# EAGLE schematic components_connections (EAGLE 9.7.0)
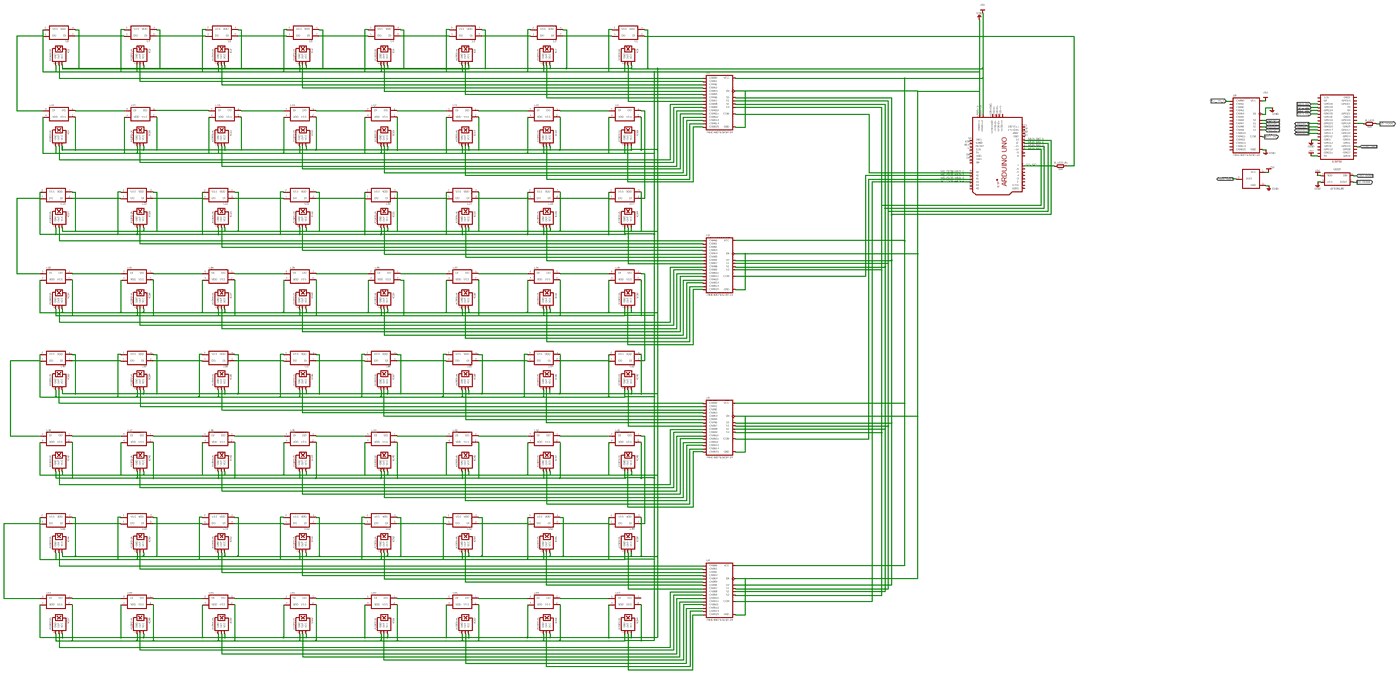
[diagram p0: schematic, sheet 1, overview]
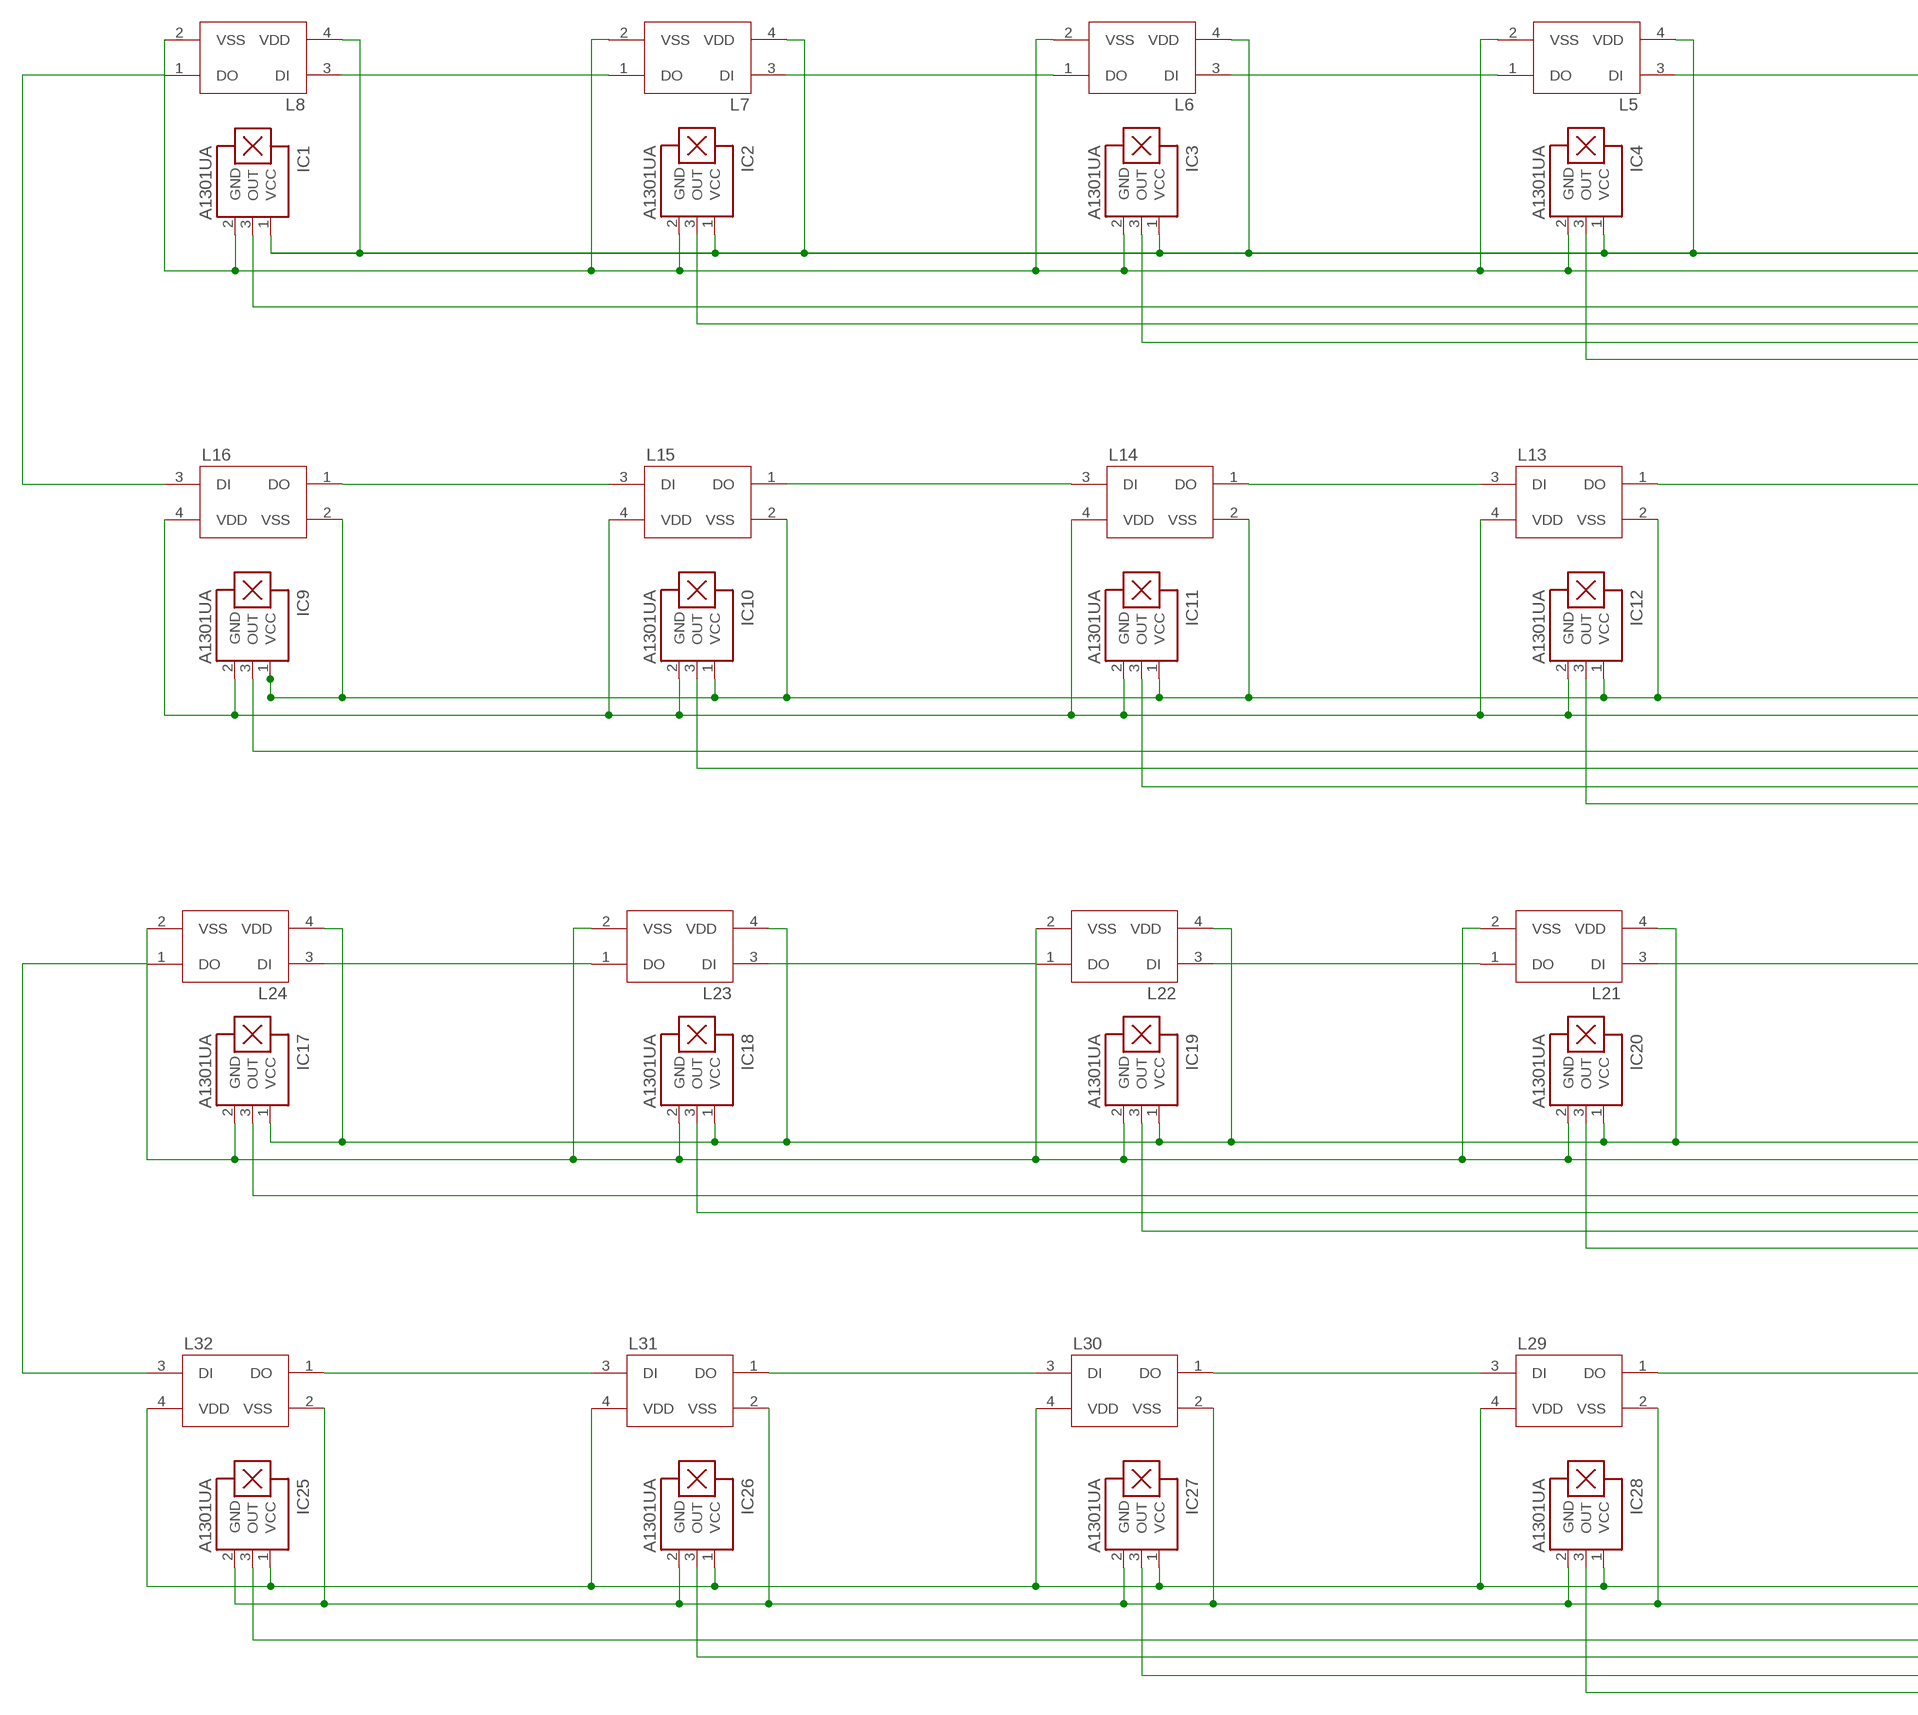
[diagram p1: schematic, sheet 1, part 1 of 5]
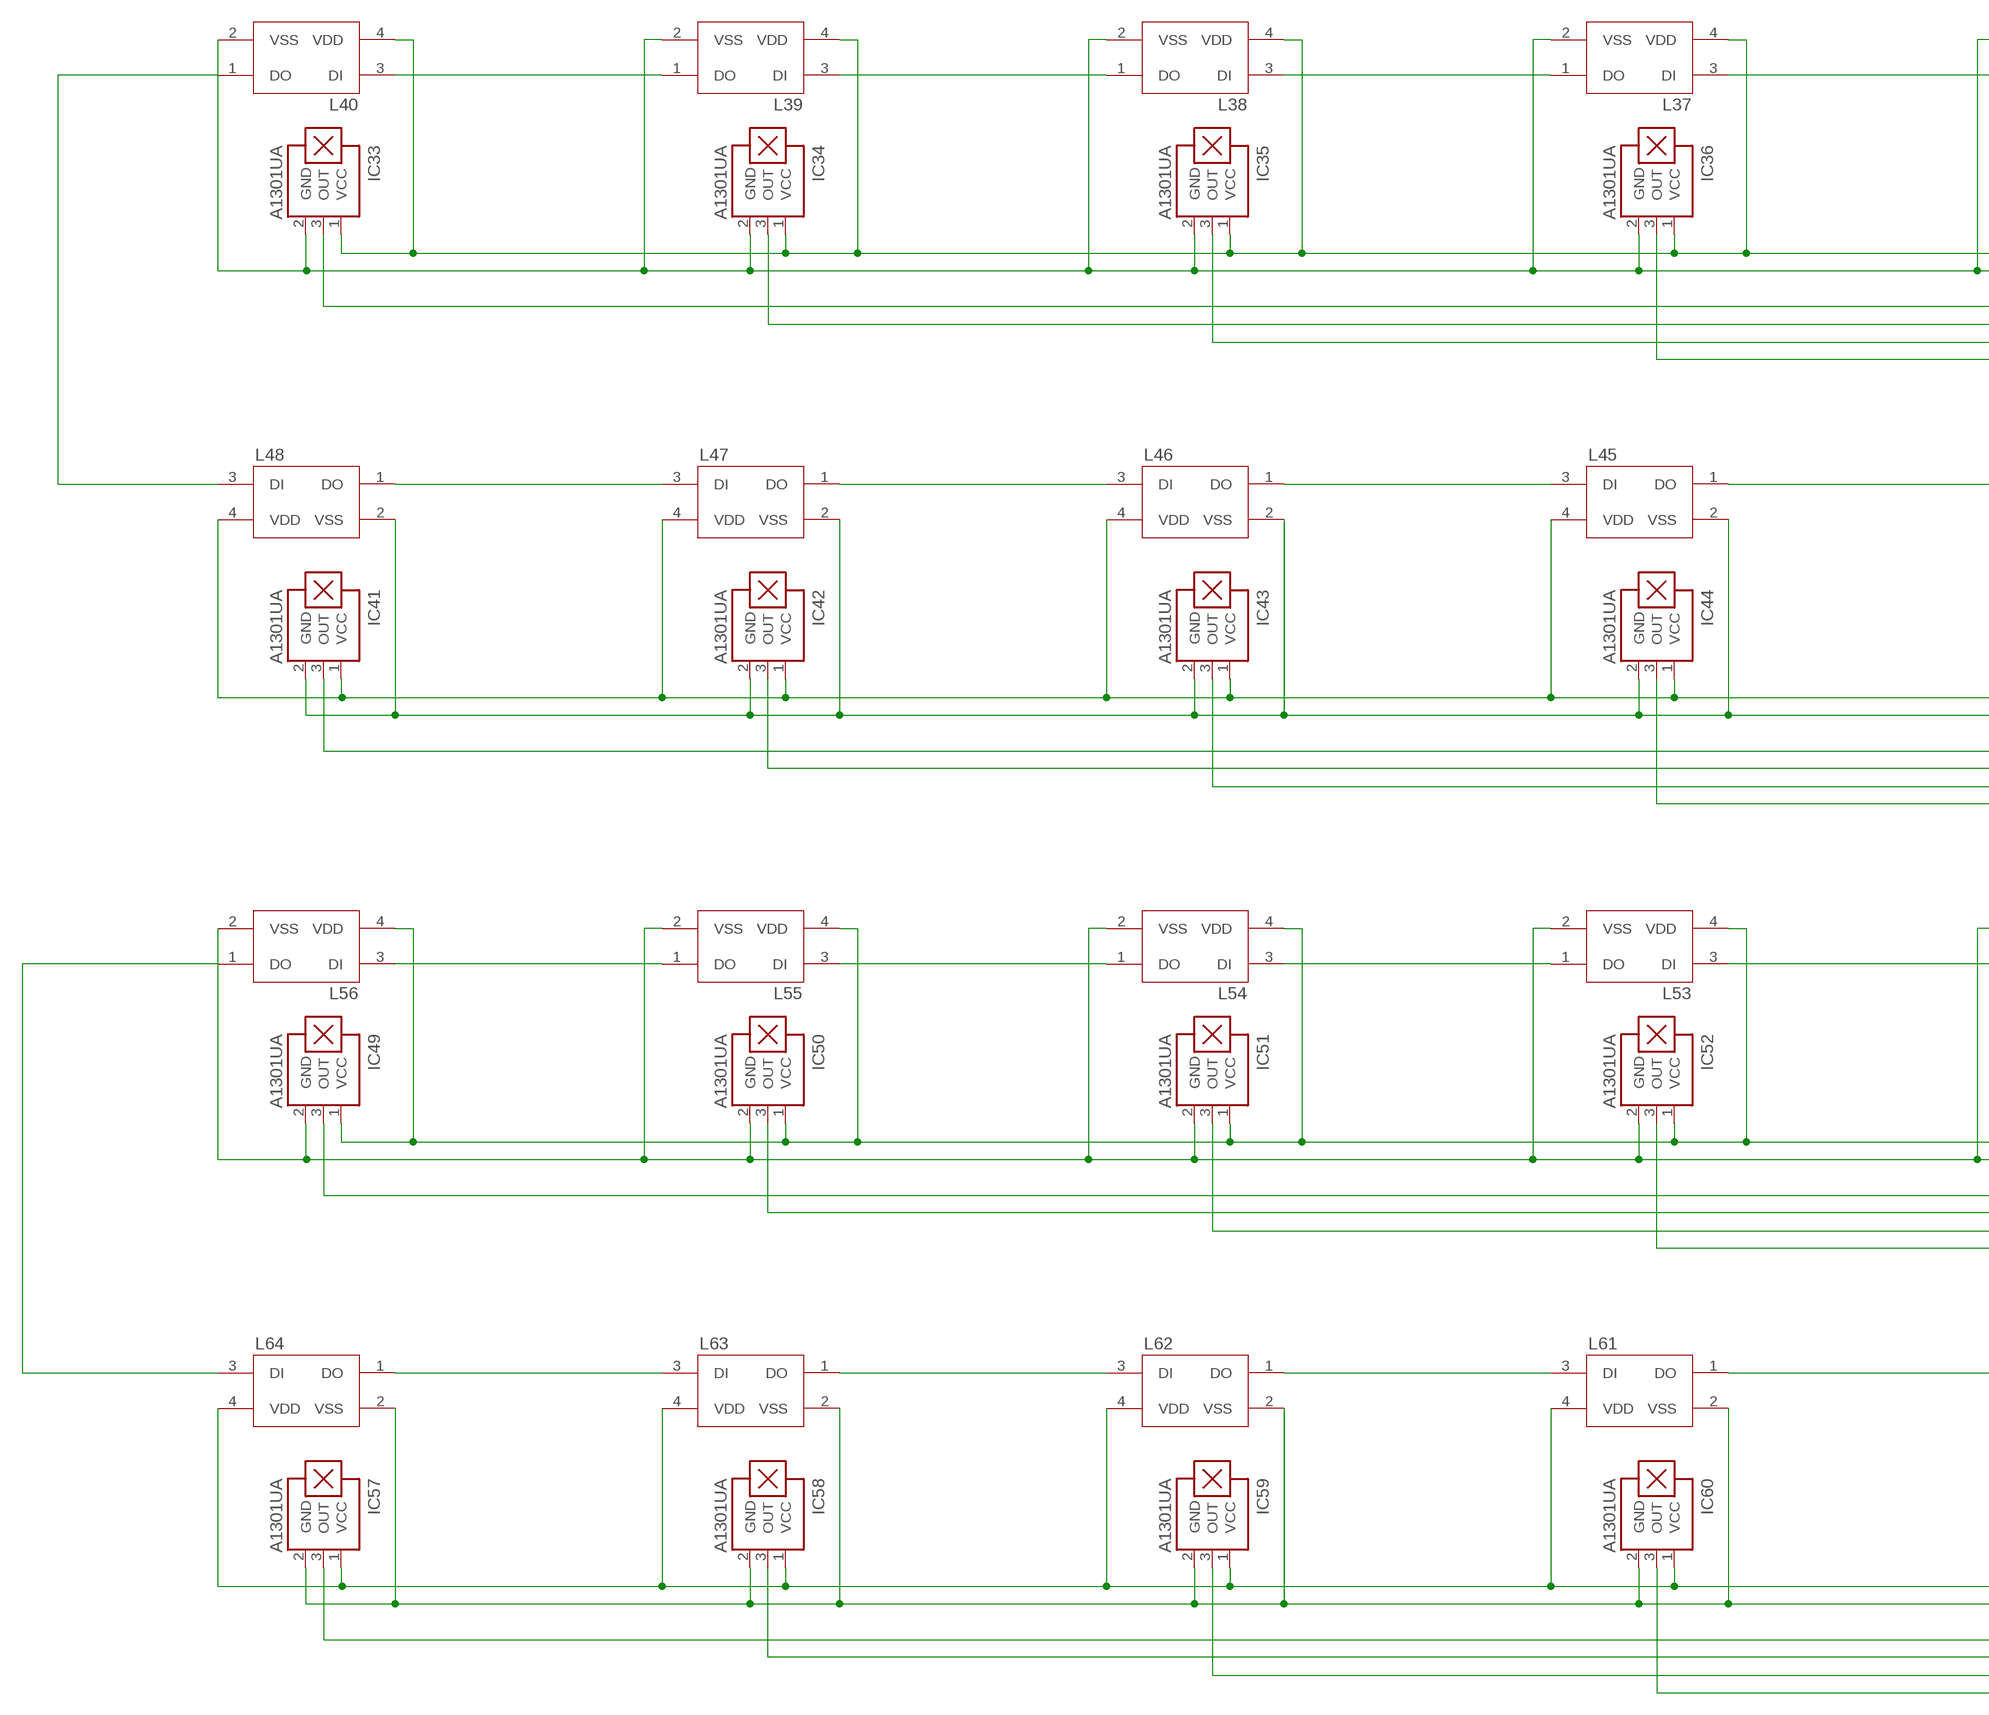
[diagram p2: schematic, sheet 1, part 2 of 5]
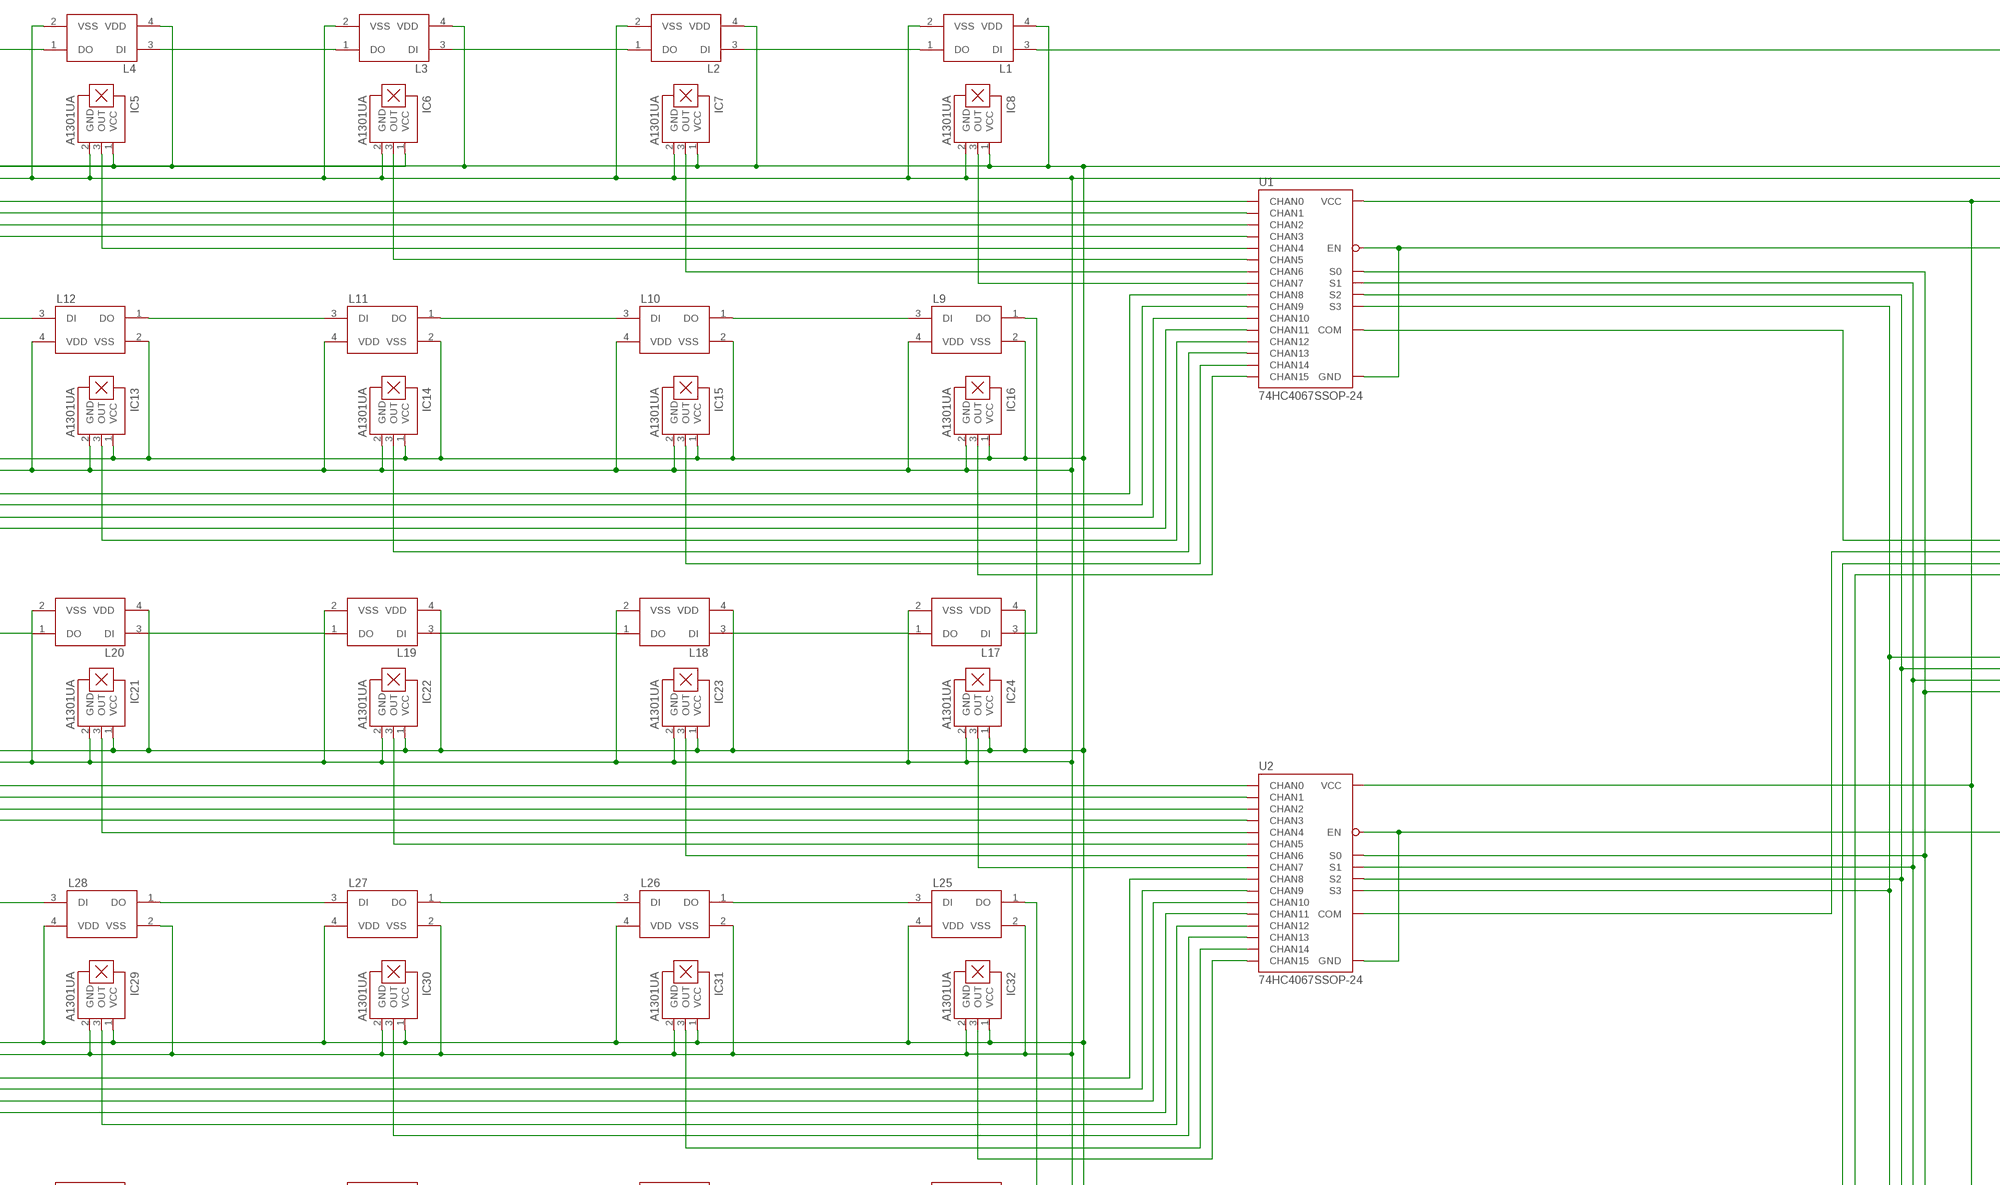
[diagram p3: schematic, sheet 1, part 3 of 5]
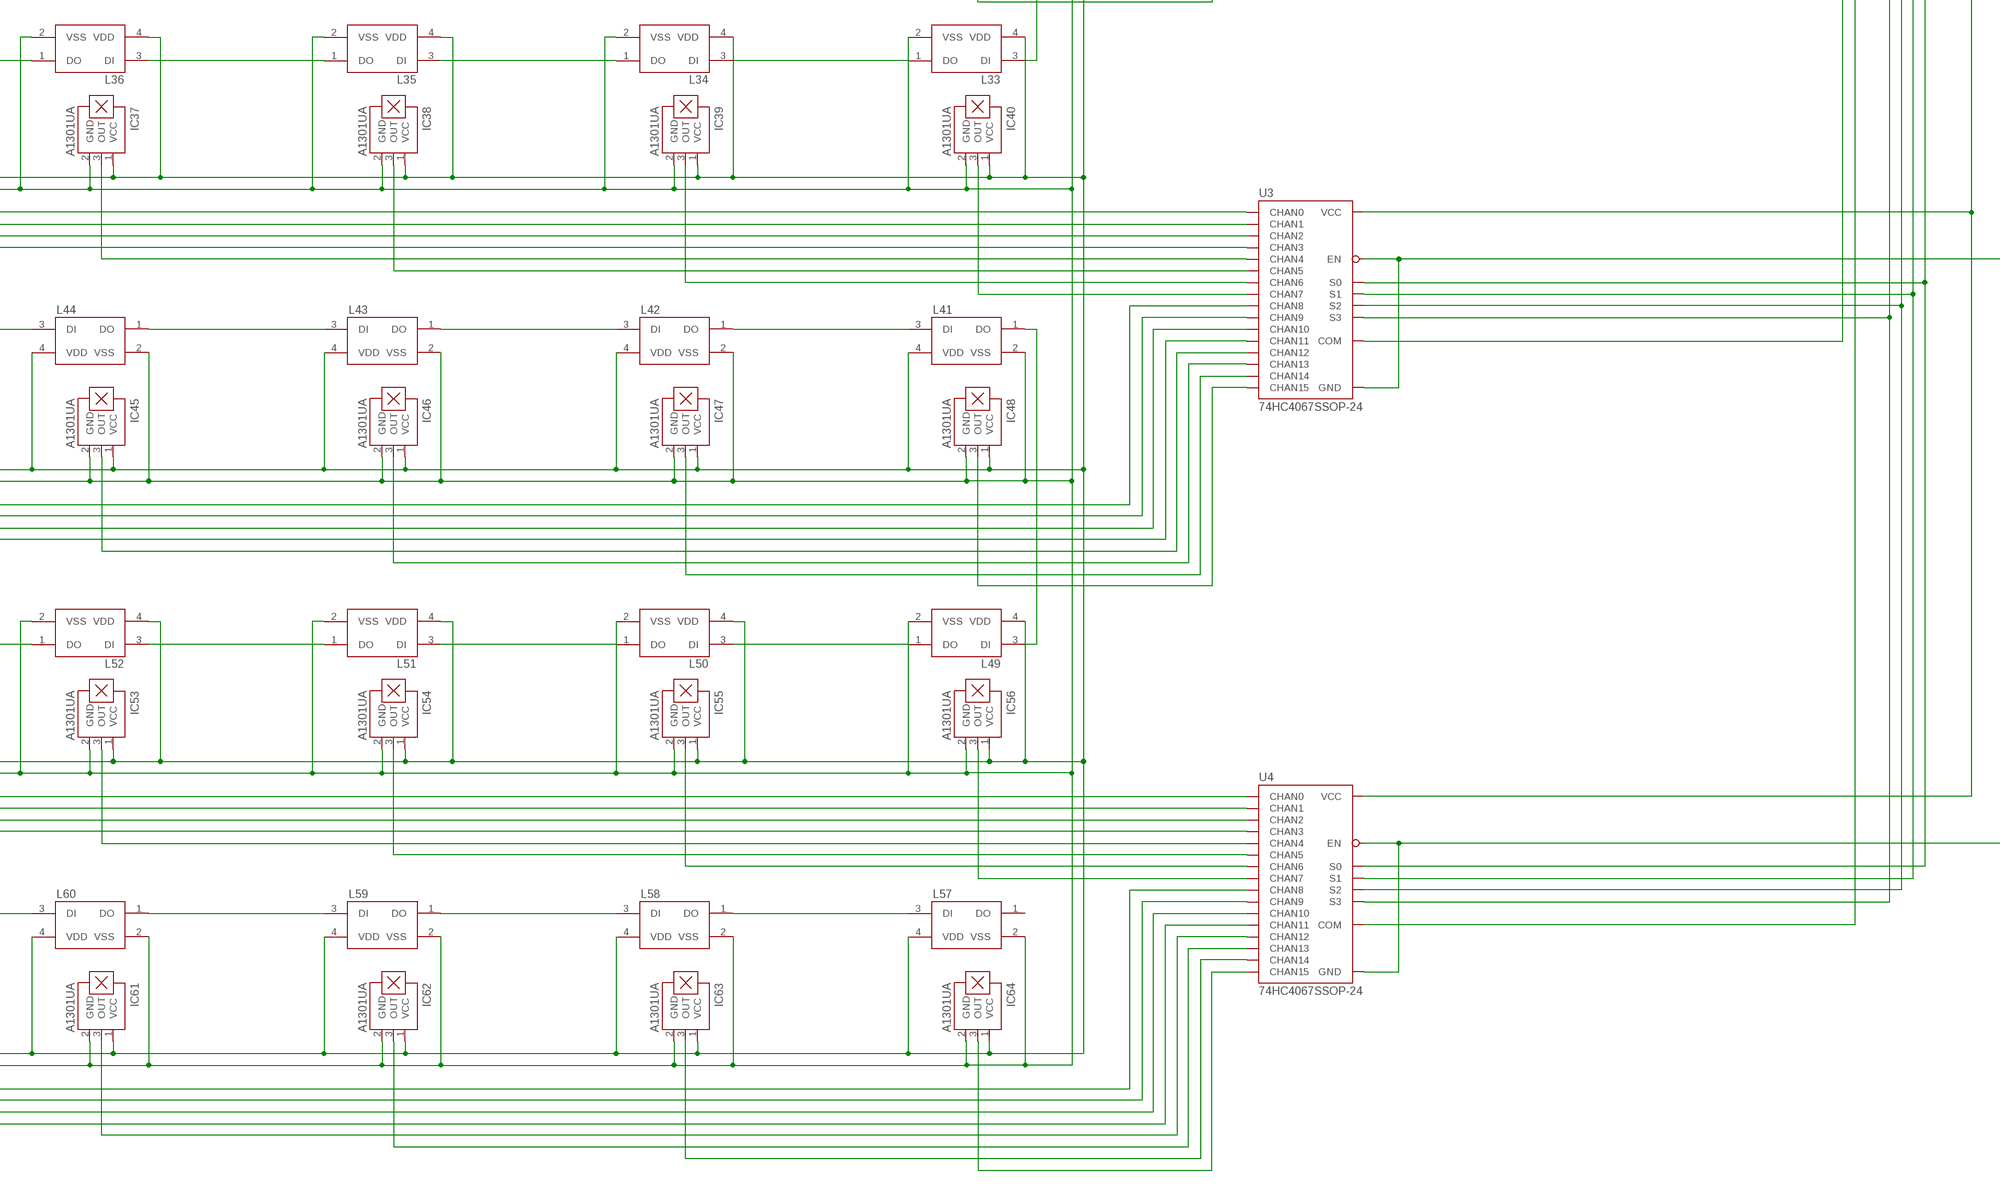
[diagram p4: schematic, sheet 1, part 4 of 5]
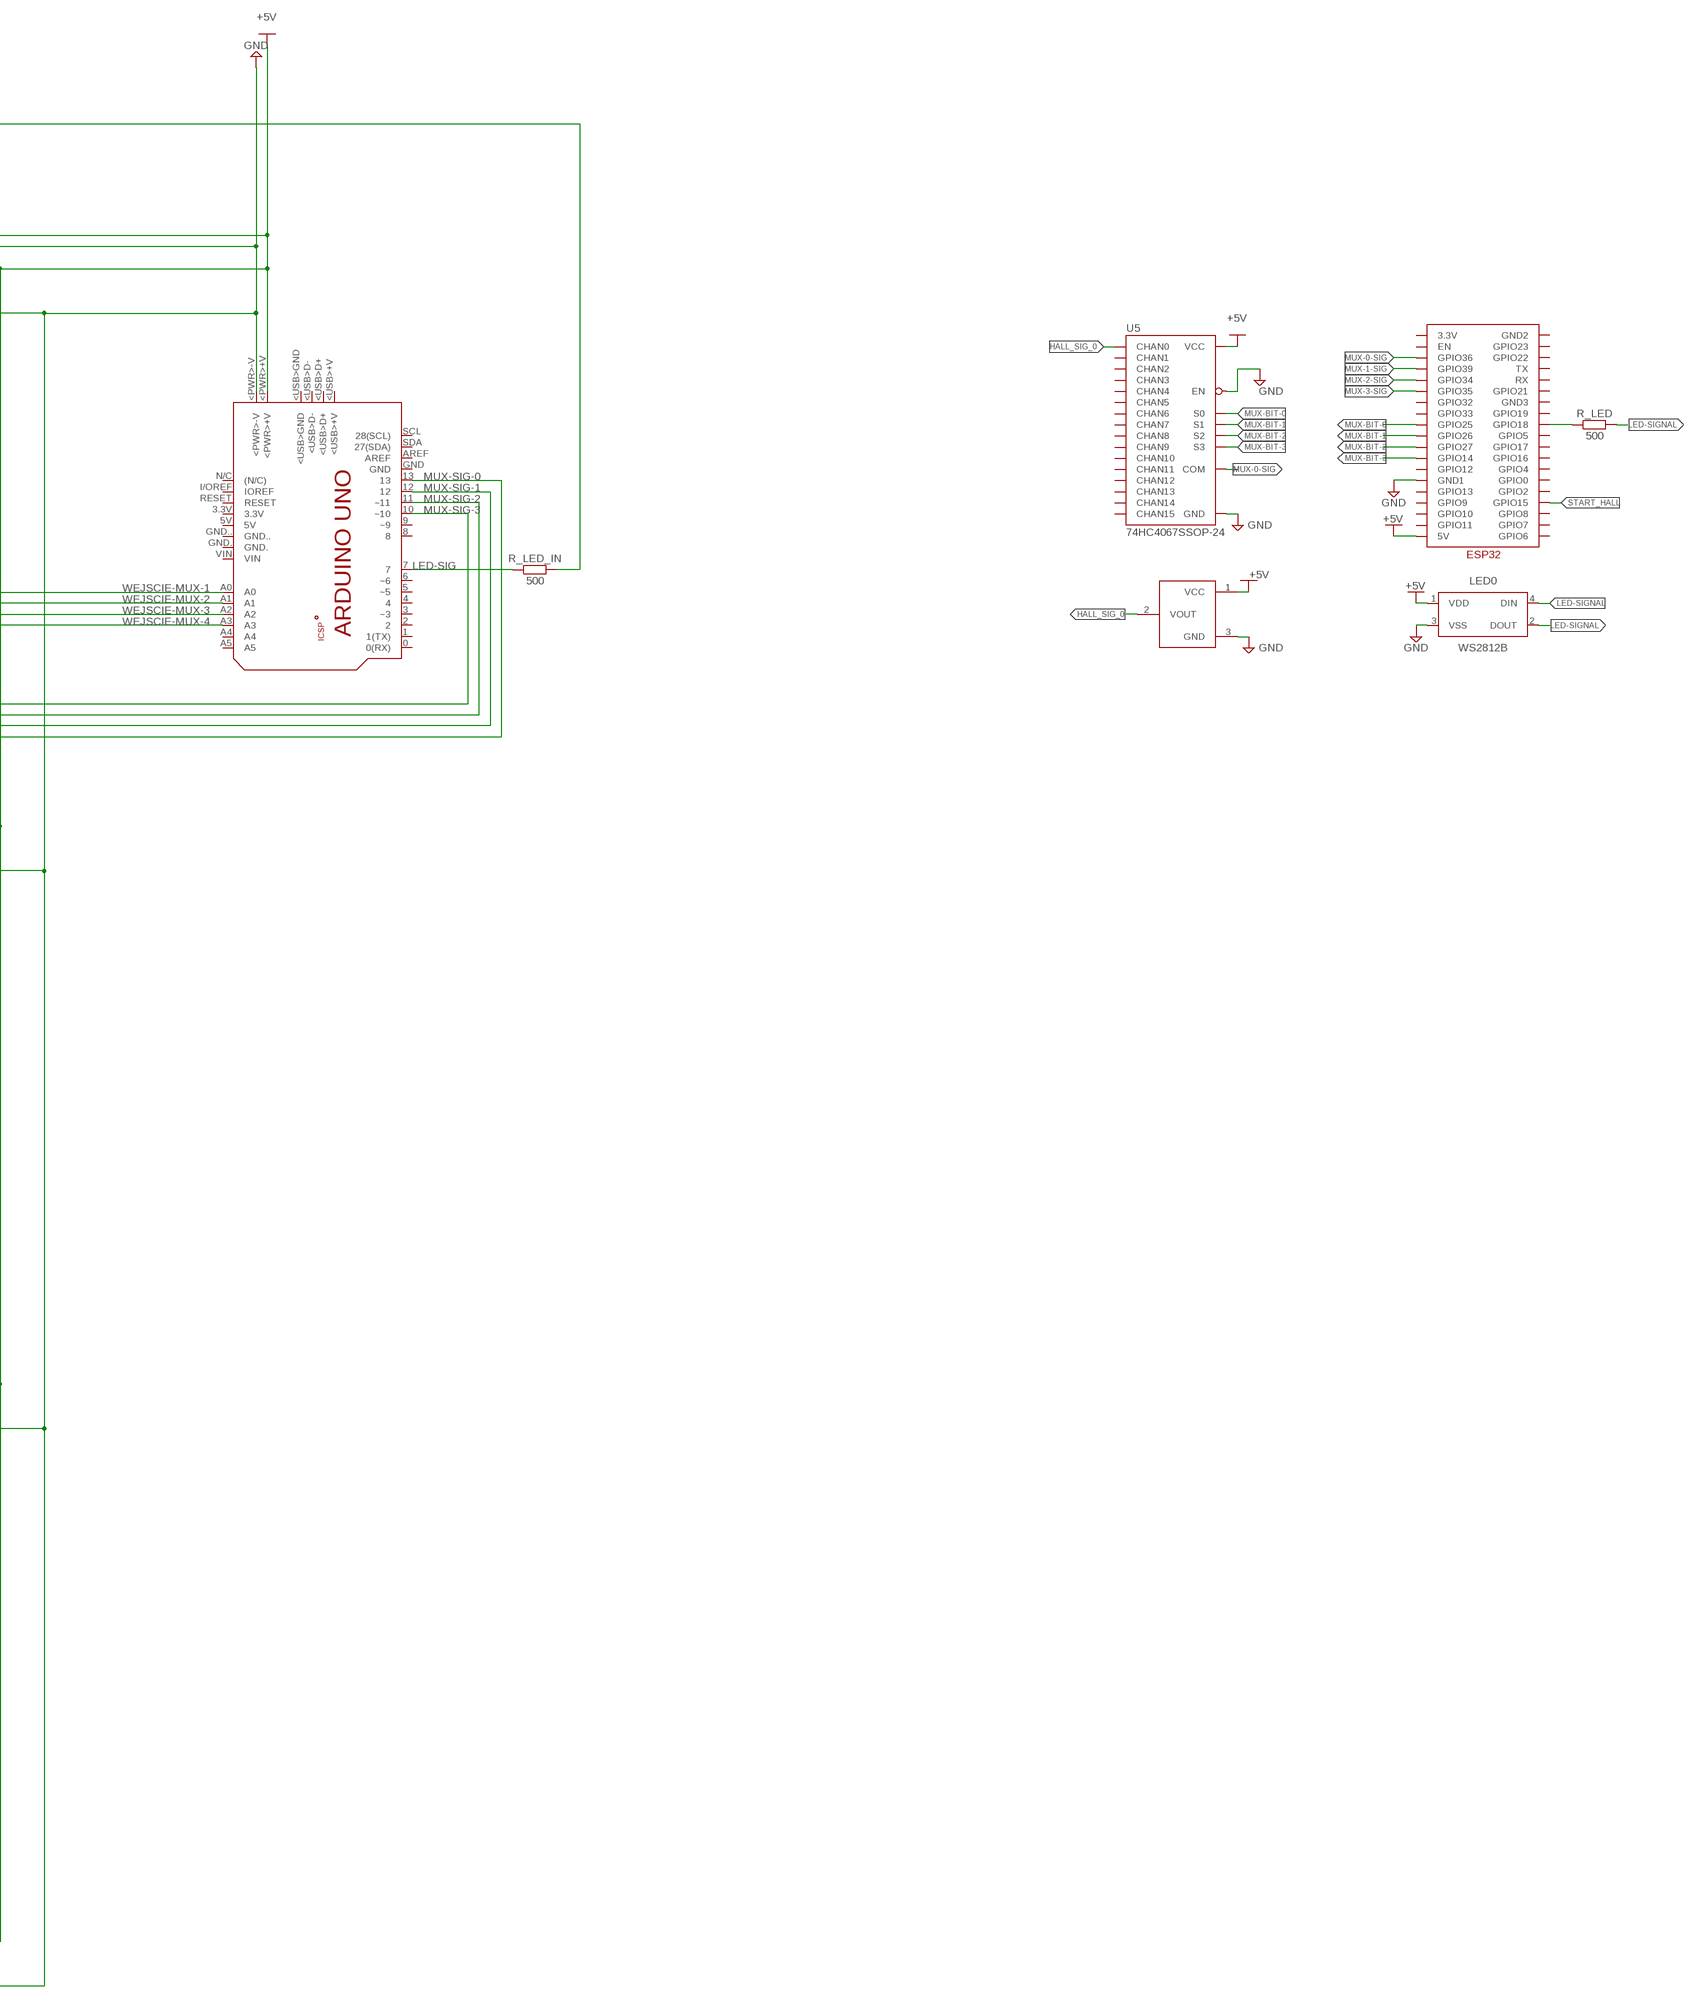
[diagram p5: schematic, sheet 1, part 5 of 5]

## Parts
IC1  A1301UA  [SIP3-UA]
IC2  A1301UA  [SIP3-UA]
IC3  A1301UA  [SIP3-UA]
IC4  A1301UA  [SIP3-UA]
IC5  A1301UA  [SIP3-UA]
IC6  A1301UA  [SIP3-UA]
IC7  A1301UA  [SIP3-UA]
IC8  A1301UA  [SIP3-UA]
IC9  A1301UA  [SIP3-UA]
IC10  A1301UA  [SIP3-UA]
IC11  A1301UA  [SIP3-UA]
IC12  A1301UA  [SIP3-UA]
IC13  A1301UA  [SIP3-UA]
IC14  A1301UA  [SIP3-UA]
IC15  A1301UA  [SIP3-UA]
IC16  A1301UA  [SIP3-UA]
IC17  A1301UA  [SIP3-UA]
IC18  A1301UA  [SIP3-UA]
IC19  A1301UA  [SIP3-UA]
IC20  A1301UA  [SIP3-UA]
IC21  A1301UA  [SIP3-UA]
IC22  A1301UA  [SIP3-UA]
IC23  A1301UA  [SIP3-UA]
IC24  A1301UA  [SIP3-UA]
IC25  A1301UA  [SIP3-UA]
IC26  A1301UA  [SIP3-UA]
IC27  A1301UA  [SIP3-UA]
IC28  A1301UA  [SIP3-UA]
IC29  A1301UA  [SIP3-UA]
IC30  A1301UA  [SIP3-UA]
IC31  A1301UA  [SIP3-UA]
IC32  A1301UA  [SIP3-UA]
IC33  A1301UA  [SIP3-UA]
IC34  A1301UA  [SIP3-UA]
IC35  A1301UA  [SIP3-UA]
IC36  A1301UA  [SIP3-UA]
IC37  A1301UA  [SIP3-UA]
IC38  A1301UA  [SIP3-UA]
IC39  A1301UA  [SIP3-UA]
IC40  A1301UA  [SIP3-UA]
IC41  A1301UA  [SIP3-UA]
IC42  A1301UA  [SIP3-UA]
IC43  A1301UA  [SIP3-UA]
IC44  A1301UA  [SIP3-UA]
IC45  A1301UA  [SIP3-UA]
IC46  A1301UA  [SIP3-UA]
IC47  A1301UA  [SIP3-UA]
IC48  A1301UA  [SIP3-UA]
IC49  A1301UA  [SIP3-UA]
IC50  A1301UA  [SIP3-UA]
IC51  A1301UA  [SIP3-UA]
IC52  A1301UA  [SIP3-UA]
IC53  A1301UA  [SIP3-UA]
IC54  A1301UA  [SIP3-UA]
IC55  A1301UA  [SIP3-UA]
IC56  A1301UA  [SIP3-UA]
IC57  A1301UA  [SIP3-UA]
IC58  A1301UA  [SIP3-UA]
IC59  A1301UA  [SIP3-UA]
IC60  A1301UA  [SIP3-UA]
IC61  A1301UA  [SIP3-UA]
IC62  A1301UA  [SIP3-UA]
IC63  A1301UA  [SIP3-UA]
IC64  A1301UA  [SIP3-UA]
L1  WS2812B-2020  [WS2812B-2020]
L2  WS2812B-2020  [WS2812B-2020]
L3  WS2812B-2020  [WS2812B-2020]
L4  WS2812B-2020  [WS2812B-2020]
L5  WS2812B-2020  [WS2812B-2020]
L6  WS2812B-2020  [WS2812B-2020]
L7  WS2812B-2020  [WS2812B-2020]
L8  WS2812B-2020  [WS2812B-2020]
L9  WS2812B-2020  [WS2812B-2020]
L10  WS2812B-2020  [WS2812B-2020]
L11  WS2812B-2020  [WS2812B-2020]
L12  WS2812B-2020  [WS2812B-2020]
L13  WS2812B-2020  [WS2812B-2020]
L14  WS2812B-2020  [WS2812B-2020]
L15  WS2812B-2020  [WS2812B-2020]
L16  WS2812B-2020  [WS2812B-2020]
L17  WS2812B-2020  [WS2812B-2020]
L18  WS2812B-2020  [WS2812B-2020]
L19  WS2812B-2020  [WS2812B-2020]
L20  WS2812B-2020  [WS2812B-2020]
L21  WS2812B-2020  [WS2812B-2020]
L22  WS2812B-2020  [WS2812B-2020]
L23  WS2812B-2020  [WS2812B-2020]
L24  WS2812B-2020  [WS2812B-2020]
L25  WS2812B-2020  [WS2812B-2020]
L26  WS2812B-2020  [WS2812B-2020]
L27  WS2812B-2020  [WS2812B-2020]
L28  WS2812B-2020  [WS2812B-2020]
L29  WS2812B-2020  [WS2812B-2020]
L30  WS2812B-2020  [WS2812B-2020]
L31  WS2812B-2020  [WS2812B-2020]
L32  WS2812B-2020  [WS2812B-2020]
L33  WS2812B-2020  [WS2812B-2020]
L34  WS2812B-2020  [WS2812B-2020]
L35  WS2812B-2020  [WS2812B-2020]
L36  WS2812B-2020  [WS2812B-2020]
L37  WS2812B-2020  [WS2812B-2020]
L38  WS2812B-2020  [WS2812B-2020]
L39  WS2812B-2020  [WS2812B-2020]
L40  WS2812B-2020  [WS2812B-2020]
L41  WS2812B-2020  [WS2812B-2020]
L42  WS2812B-2020  [WS2812B-2020]
L43  WS2812B-2020  [WS2812B-2020]
L44  WS2812B-2020  [WS2812B-2020]
L45  WS2812B-2020  [WS2812B-2020]
L46  WS2812B-2020  [WS2812B-2020]
L47  WS2812B-2020  [WS2812B-2020]
L48  WS2812B-2020  [WS2812B-2020]
L49  WS2812B-2020  [WS2812B-2020]
L50  WS2812B-2020  [WS2812B-2020]
L51  WS2812B-2020  [WS2812B-2020]
L52  WS2812B-2020  [WS2812B-2020]
L53  WS2812B-2020  [WS2812B-2020]
L54  WS2812B-2020  [WS2812B-2020]
L55  WS2812B-2020  [WS2812B-2020]
L56  WS2812B-2020  [WS2812B-2020]
L57  WS2812B-2020  [WS2812B-2020]
L58  WS2812B-2020  [WS2812B-2020]
L59  WS2812B-2020  [WS2812B-2020]
L60  WS2812B-2020  [WS2812B-2020]
L61  WS2812B-2020  [WS2812B-2020]
L62  WS2812B-2020  [WS2812B-2020]
L63  WS2812B-2020  [WS2812B-2020]
L64  WS2812B-2020  [WS2812B-2020]
LED0  WS2812B  [WS2812B]
PCB1  ARDUINO_UNO  [ARDUINO_UNO]
R_LED  500  R_AXIAL-7.2MM-PITCH  [RESAD724W46L381D178B]
R_LED_IN  500  R_AXIAL-7.2MM-PITCH  [RESAD724W46L381D178B]
U1  74HC4067SSOP-24  [SSOP24]
U2  74HC4067SSOP-24  [SSOP24]
U3  74HC4067SSOP-24  [SSOP24]
U4  74HC4067SSOP-24  [SSOP24]
U5  74HC4067SSOP-24  [SSOP24]
U6  A1324LLHLT-T  [SOT-23W]
U$1  ESP32  [ESP32]

## Nets
+5V: IC1.1(VCC) IC7.1(VCC) IC8.1(VCC) IC9.1(VCC) IC10.1(VCC) IC11.1(VCC) IC12.1(VCC) IC13.1(VCC) IC14.1(VCC) IC15.1(VCC) IC16.1(VCC) IC17.1(VCC) IC18.1(VCC) IC19.1(VCC) IC20.1(VCC) IC21.1(VCC) IC22.1(VCC) IC23.1(VCC) IC24.1(VCC) IC25.1(VCC) IC26.1(VCC) IC27.1(VCC) IC28.1(VCC) IC29.1(VCC) IC30.1(VCC) IC31.1(VCC) IC32.1(VCC) IC33.1(VCC) IC34.1(VCC) IC35.1(VCC) IC36.1(VCC) IC37.1(VCC) IC38.1(VCC) IC39.1(VCC) IC40.1(VCC) IC41.1(VCC) IC42.1(VCC) IC43.1(VCC) IC44.1(VCC) IC45.1(VCC) IC46.1(VCC) IC47.1(VCC) IC48.1(VCC) IC49.1(VCC) IC50.1(VCC) IC51.1(VCC) IC52.1(VCC) IC53.1(VCC) IC54.1(VCC) IC55.1(VCC) IC56.1(VCC) IC57.1(VCC) IC58.1(VCC) IC59.1(VCC) IC60.1(VCC) IC61.1(VCC) IC62.1(VCC) IC63.1(VCC) IC64.1(VCC) L1.4(VDD) L2.4(VDD) L3.4(VDD) L9.2(VSS) L10.2(VSS) L11.2(VSS) L12.2(VSS) L13.2(VSS) L14.2(VSS) L15.2(VSS) L16.2(VSS) L17.4(VDD) L18.4(VDD) L19.4(VDD) L20.4(VDD) L21.4(VDD) L22.4(VDD) L23.4(VDD) L24.4(VDD) L25.4(VDD) L26.4(VDD) L27.4(VDD) L28.4(VDD) L29.4(VDD) L30.4(VDD) L31.4(VDD) L32.4(VDD) L33.4(VDD) L34.4(VDD) L35.4(VDD) L36.4(VDD) L37.4(VDD) L38.4(VDD) L39.4(VDD) L40.4(VDD) L41.4(VDD) L42.4(VDD) L43.4(VDD) L44.4(VDD) L45.4(VDD) L46.4(VDD) L47.4(VDD) L48.4(VDD) L49.4(VDD) L50.4(VDD) L51.4(VDD) L52.4(VDD) L53.4(VDD) L54.4(VDD) L55.4(VDD) L56.4(VDD) L57.4(VDD) L58.4(VDD) L59.4(VDD) L60.4(VDD) L61.4(VDD) L62.4(VDD) L63.4(VDD) L64.4(VDD) LED0.1(VDD) PCB1.<PWR>+V U1.24(VCC) U2.24(VCC) U3.24(VCC) U4.24(VCC) U5.24(VCC) U6.1(VCC) U$1.5V
GND: IC1.2(GND) IC2.2(GND) IC3.2(GND) IC4.2(GND) IC5.2(GND) IC6.2(GND) IC7.2(GND) IC8.2(GND) IC9.2(GND) IC10.2(GND) IC11.2(GND) IC12.2(GND) IC13.2(GND) IC14.2(GND) IC15.2(GND) IC16.2(GND) IC17.2(GND) IC18.2(GND) IC19.2(GND) IC20.2(GND) IC21.2(GND) IC22.2(GND) IC23.2(GND) IC24.2(GND) IC25.2(GND) IC26.2(GND) IC27.2(GND) IC28.2(GND) IC29.2(GND) IC30.2(GND) IC31.2(GND) IC32.2(GND) IC33.2(GND) IC34.2(GND) IC35.2(GND) IC36.2(GND) IC37.2(GND) IC38.2(GND) IC39.2(GND) IC40.2(GND) IC41.2(GND) IC42.2(GND) IC43.2(GND) IC44.2(GND) IC45.2(GND) IC46.2(GND) IC47.2(GND) IC48.2(GND) IC49.2(GND) IC50.2(GND) IC51.2(GND) IC52.2(GND) IC53.2(GND) IC54.2(GND) IC55.2(GND) IC56.2(GND) IC57.2(GND) IC58.2(GND) IC59.2(GND) IC60.2(GND) IC61.2(GND) IC62.2(GND) IC63.2(GND) IC64.2(GND) L1.2(VSS) L2.2(VSS) L3.2(VSS) L4.2(VSS) L5.2(VSS) L6.2(VSS) L7.2(VSS) L8.2(VSS) L9.4(VDD) L10.4(VDD) L11.4(VDD) L12.4(VDD) L13.4(VDD) L14.4(VDD) L15.4(VDD) L16.4(VDD) L17.2(VSS) L18.2(VSS) L19.2(VSS) L20.2(VSS) L21.2(VSS) L22.2(VSS) L23.2(VSS) L24.2(VSS) L25.2(VSS) L26.2(VSS) L27.2(VSS) L28.2(VSS) L29.2(VSS) L30.2(VSS) L31.2(VSS) L32.2(VSS) L33.2(VSS) L34.2(VSS) L35.2(VSS) L36.2(VSS) L37.2(VSS) L38.2(VSS) L39.2(VSS) L40.2(VSS) L41.2(VSS) L42.2(VSS) L43.2(VSS) L44.2(VSS) L45.2(VSS) L46.2(VSS) L47.2(VSS) L48.2(VSS) L49.2(VSS) L50.2(VSS) L51.2(VSS) L52.2(VSS) L53.2(VSS) L54.2(VSS) L55.2(VSS) L56.2(VSS) L57.2(VSS) L58.2(VSS) L59.2(VSS) L60.2(VSS) L61.2(VSS) L62.2(VSS) L63.2(VSS) L64.2(VSS) LED0.3(VSS) PCB1.<PWR>-V U1.12(GND) U1.15(EN) U2.12(GND) U2.15(EN) U3.12(GND) U3.15(EN) U4.12(GND) U4.15(EN) U5.12(GND) U5.15(EN) U6.3(GND) U$1.GND1
HALL_SIG_0: U6.2(VOUT)
LED-SIG: PCB1.7 R_LED_IN.1
LED-SIGNAL: R_LED.1 U$1.GPIO18
MUX-0-SIG: U$1.GPIO36
MUX-1-SIG: U$1.GPIO39
MUX-2-SIG: U$1.GPIO34
MUX-3-SIG: U$1.GPIO35
MUX-BIT-0: U5.10(S0) U$1.GPIO25
MUX-BIT-1: U5.11(S1) U$1.GPIO26
MUX-BIT-2: U5.14(S2) U$1.GPIO27
MUX-BIT-3: U5.13(S3) U$1.GPIO14
MUX-SIG-0: PCB1.13 U1.10(S0) U2.10(S0) U3.10(S0) U4.10(S0)
MUX-SIG-1: PCB1.12 U1.11(S1) U2.11(S1) U3.11(S1) U4.11(S1)
MUX-SIG-2: PCB1.11(~11) U1.14(S2) U2.14(S2) U3.14(S2) U4.14(S2)
MUX-SIG-3: PCB1.10(~10) U1.13(S3) U2.13(S3) U3.13(S3) U4.13(S3)
N$1: L1.3(DI) R_LED_IN.2
N$2: IC1.3(OUT) U1.9(CHAN0)
N$3: IC2.3(OUT) U1.8(CHAN1)
N$4: IC3.3(OUT) U1.7(CHAN2)
N$5: IC4.3(OUT) U1.6(CHAN3)
N$6: IC5.3(OUT) U1.5(CHAN4)
N$7: IC6.3(OUT) U1.4(CHAN5)
N$8: IC7.3(OUT) U1.3(CHAN6)
N$9: L1.1(DO) L2.3(DI)
N$10: IC2.1(VCC) IC3.1(VCC) IC4.1(VCC) IC5.1(VCC) IC6.1(VCC) L4.4(VDD) L5.4(VDD) L6.4(VDD) L7.4(VDD) L8.4(VDD)
N$11: IC8.3(OUT) U1.2(CHAN7)
N$12: IC9.3(OUT) U1.23(CHAN8)
N$13: IC10.3(OUT) U1.22(CHAN9)
N$14: IC11.3(OUT) U1.21(CHAN10)
N$15: IC12.3(OUT) U1.20(CHAN11)
N$16: IC13.3(OUT) U1.19(CHAN12)
N$17: IC14.3(OUT) U1.18(CHAN13)
N$18: IC15.3(OUT) U1.17(CHAN14)
N$19: IC16.3(OUT) U1.16(CHAN15)
N$20: IC17.3(OUT) U2.9(CHAN0)
N$21: IC18.3(OUT) U2.8(CHAN1)
N$22: IC19.3(OUT) U2.7(CHAN2)
N$23: IC20.3(OUT) U2.6(CHAN3)
N$24: IC21.3(OUT) U2.5(CHAN4)
N$25: IC22.3(OUT) U2.4(CHAN5)
N$26: IC23.3(OUT) U2.3(CHAN6)
N$27: IC24.3(OUT) U2.2(CHAN7)
N$28: IC25.3(OUT) U2.23(CHAN8)
N$29: IC26.3(OUT) U2.22(CHAN9)
N$30: IC27.3(OUT) U2.21(CHAN10)
N$31: IC28.3(OUT) U2.20(CHAN11)
N$32: IC29.3(OUT) U2.19(CHAN12)
N$33: IC30.3(OUT) U2.18(CHAN13)
N$34: IC31.3(OUT) U2.17(CHAN14)
N$35: IC32.3(OUT) U2.16(CHAN15)
N$36: IC33.3(OUT) U3.9(CHAN0)
N$37: IC34.3(OUT) U3.8(CHAN1)
N$38: IC36.3(OUT) U3.6(CHAN3)
N$39: IC35.3(OUT) U3.7(CHAN2)
N$40: IC37.3(OUT) U3.5(CHAN4)
N$41: IC38.3(OUT) U3.4(CHAN5)
N$42: IC39.3(OUT) U3.3(CHAN6)
N$43: IC40.3(OUT) U3.2(CHAN7)
N$44: IC41.3(OUT) U3.23(CHAN8)
N$45: IC42.3(OUT) U3.22(CHAN9)
N$46: IC43.3(OUT) U3.21(CHAN10)
N$47: IC44.3(OUT) U3.20(CHAN11)
N$48: IC45.3(OUT) U3.19(CHAN12)
N$49: IC46.3(OUT) U3.18(CHAN13)
N$50: IC47.3(OUT) U3.17(CHAN14)
N$51: IC48.3(OUT) U3.16(CHAN15)
N$52: IC49.3(OUT) U4.9(CHAN0)
N$53: IC50.3(OUT) U4.8(CHAN1)
N$54: IC51.3(OUT) U4.7(CHAN2)
N$55: IC52.3(OUT) U4.6(CHAN3)
N$56: IC53.3(OUT) U4.5(CHAN4)
N$57: IC54.3(OUT) U4.4(CHAN5)
N$58: IC55.3(OUT) U4.3(CHAN6)
N$59: IC56.3(OUT) U4.2(CHAN7)
N$60: IC57.3(OUT) U4.23(CHAN8)
N$61: IC58.3(OUT) U4.22(CHAN9)
N$62: IC59.3(OUT) U4.21(CHAN10)
N$63: IC60.3(OUT) U4.20(CHAN11)
N$64: IC61.3(OUT) U4.19(CHAN12)
N$65: IC62.3(OUT) U4.18(CHAN13)
N$66: IC63.3(OUT) U4.17(CHAN14)
N$67: IC64.3(OUT) U4.16(CHAN15)
N$68: L2.1(DO) L3.3(DI)
N$69: R_LED.2
N$70: U5.1(COM)
N$71: LED0.2(DOUT)
N$72: LED0.4(DIN)
N$73: U5.9(CHAN0)
N$77: L3.1(DO) L4.3(DI)
N$78: L4.1(DO) L5.3(DI)
N$79: L5.1(DO) L6.3(DI)
N$80: L6.1(DO) L7.3(DI)
N$81: L7.1(DO) L8.3(DI)
N$82: L8.1(DO) L16.3(DI)
N$83: L15.3(DI) L16.1(DO)
N$84: L14.3(DI) L15.1(DO)
N$85: L13.3(DI) L14.1(DO)
N$86: L12.3(DI) L13.1(DO)
N$87: L11.3(DI) L12.1(DO)
N$88: L10.3(DI) L11.1(DO)
N$89: L9.3(DI) L10.1(DO)
N$90: L9.1(DO) L17.3(DI)
N$91: L17.1(DO) L18.3(DI)
N$92: L18.1(DO) L19.3(DI)
N$93: L19.1(DO) L20.3(DI)
N$94: L20.1(DO) L21.3(DI)
N$95: L21.1(DO) L22.3(DI)
N$96: L22.1(DO) L23.3(DI)
N$97: L23.1(DO) L24.3(DI)
N$98: L24.1(DO) L32.3(DI)
N$99: L31.3(DI) L32.1(DO)
N$100: L30.3(DI) L31.1(DO)
N$101: L29.3(DI) L30.1(DO)
N$102: L28.3(DI) L29.1(DO)
N$103: L27.3(DI) L28.1(DO)
N$104: L26.3(DI) L27.1(DO)
N$105: L25.3(DI) L26.1(DO)
N$106: L25.1(DO) L33.3(DI)
N$107: L33.1(DO) L34.3(DI)
N$108: L34.1(DO) L35.3(DI)
N$109: L35.1(DO) L36.3(DI)
N$110: L36.1(DO) L37.3(DI)
N$111: L37.1(DO) L38.3(DI)
N$112: L38.1(DO) L39.3(DI)
N$113: L39.1(DO) L40.3(DI)
N$114: L40.1(DO) L48.3(DI)
N$115: L47.3(DI) L48.1(DO)
N$116: L46.3(DI) L47.1(DO)
N$117: L45.3(DI) L46.1(DO)
N$118: L44.3(DI) L45.1(DO)
N$119: L43.3(DI) L44.1(DO)
N$120: L42.3(DI) L43.1(DO)
N$121: L41.3(DI) L42.1(DO)
N$122: L41.1(DO) L49.3(DI)
N$123: L49.1(DO) L50.3(DI)
N$124: L50.1(DO) L51.3(DI)
N$125: L51.1(DO) L52.3(DI)
N$126: L52.1(DO) L53.3(DI)
N$127: L53.1(DO) L54.3(DI)
N$128: L54.1(DO) L55.3(DI)
N$129: L55.1(DO) L56.3(DI)
N$130: L56.1(DO) L64.3(DI)
N$131: L63.3(DI) L64.1(DO)
N$132: L62.3(DI) L63.1(DO)
N$133: L61.3(DI) L62.1(DO)
N$134: L60.3(DI) L61.1(DO)
N$135: L59.3(DI) L60.1(DO)
N$136: L58.3(DI) L59.1(DO)
N$137: L57.3(DI) L58.1(DO)
START_HALL: U$1.GPIO15
WEJSCIE-MUX-1: PCB1.A0 U1.1(COM)
WEJSCIE-MUX-2: PCB1.A1 U2.1(COM)
WEJSCIE-MUX-3: PCB1.A2 U3.1(COM)
WEJSCIE-MUX-4: PCB1.A3 U4.1(COM)
Unconnected: L57.1(DO) PCB1.0(0(RX)) PCB1.1(1(TX)) PCB1.2 PCB1.3(~3) PCB1.3.3V PCB1.4 PCB1.5(~5) PCB1.5V PCB1.6(~6) PCB1.8 PCB1.9(~9) PCB1.+5V PCB1.<USB>+V PCB1.<USB>D+ PCB1.<USB>D- PCB1.<USB>GND PCB1.A4 PCB1.A5 PCB1.AREF PCB1.GND PCB1.GND. PCB1.GND.. PCB1.GND_ PCB1.I/OREF(IOREF) PCB1.MISO PCB1.MOSI PCB1.N/C((N/C)) PCB1.RESET PCB1.RESET. PCB1.SCK PCB1.SCL(28(SCL)) PCB1.SDA(27(SDA)) PCB1.VIN U5.2(CHAN7) U5.3(CHAN6) U5.4(CHAN5) U5.5(CHAN4) U5.6(CHAN3) U5.7(CHAN2) U5.8(CHAN1) U5.16(CHAN15) U5.17(CHAN14) U5.18(CHAN13) U5.19(CHAN12) U5.20(CHAN11) U5.21(CHAN10) U5.22(CHAN9) U5.23(CHAN8) U$1.3.3V U$1.EN U$1.GND2 U$1.GND3 U$1.GPIO0 U$1.GPIO2 U$1.GPIO4 U$1.GPIO5 U$1.GPIO6 U$1.GPIO7 U$1.GPIO8 U$1.GPIO9 U$1.GPIO10 U$1.GPIO11 U$1.GPIO12 U$1.GPIO13 U$1.GPIO16 U$1.GPIO17 U$1.GPIO19 U$1.GPIO21 U$1.GPIO22 U$1.GPIO23 U$1.GPIO32 U$1.GPIO33 U$1.RX U$1.TX

## Library data of the parts
IC1-IC64 = allegro:A13*?: Linear Hall Effect Sensor ICs Continuous-Time Ratiometric High-Temperature Operation Programmable Linear with Analog Output A1302 -Replacement- UGN3503 Source: http://www.allegromicro.com/en/Products/Part_Numbers/1301/1301.pdf http://www.allegromicro.com/en/Products/Part_Numbers/1321/1321.pdf http://www.allegromicro.com/en/Products/Part_Numbers/1381/1381.pdf; MF: ALLEGRO MICROSYSTEMS, INC.; MPN: A1301EUA-T; OC_FARNELL: 1198085; OC_NEWARK: 31K6635
L1-L64 = WS2812B-2020:WS2812B-2020: A small 2x2mm addressable RGB led; LCSC: C965555
LED0 = LED:WS2812B: Intelligent control LED integrated light source Datasheet <http://cdn.sparkfun.com/datasheets/BreakoutBoards/WS2812B.pdf>; CATEGORY: LED; COLOR: RGB; DESCRIPTION: LED integrated light source; MANUFACTURER: Worldsemi; MPN: WS2812B; OPERATING_TEMP: -25 ℃ to +80℃(TJ); PART_STATUS: Active; SUB_CATEGORY: RGB
PCB1 = E14_Arduino_revC:ARDUINO_UNO: Device for representing an Arduino Uno board with a footprint in an EAGLE design. Created by Dave Young for Element14. More EAGLE documentation at: http://www.element14.com/community/community/knode/cadsoft_eagle
R_LED R_LED_IN = Resistor:R: Resistor Fixed - Generic; CATEGORY: Resistor; SUB-CATEGORY: Fixed
U1-U5 = 74HC4067:74HC4067
U6 = Sensor:A1324LLHLT-T: SENSOR HALL EFFECT ANALOG SOT23W Manufacturer's datasheet <https://www.digikey.in/product-detail/en/allegro-microsystems-llc/A1324LLHLT-T/620-1402-2-ND/2639989>; CREATED_BY: PCBLayout.com; DIGI_KEY_PART_NUMBER: 620-1402-1-ND; MANUFACTURER: Allegro MicroSystems, LLC; MPN: A1324LLHLT-T; PACKAGE: SOT-23W
U$1 = ESP32:ESP32